# EAGLE schematic bitbang (EAGLE 7.4.0)
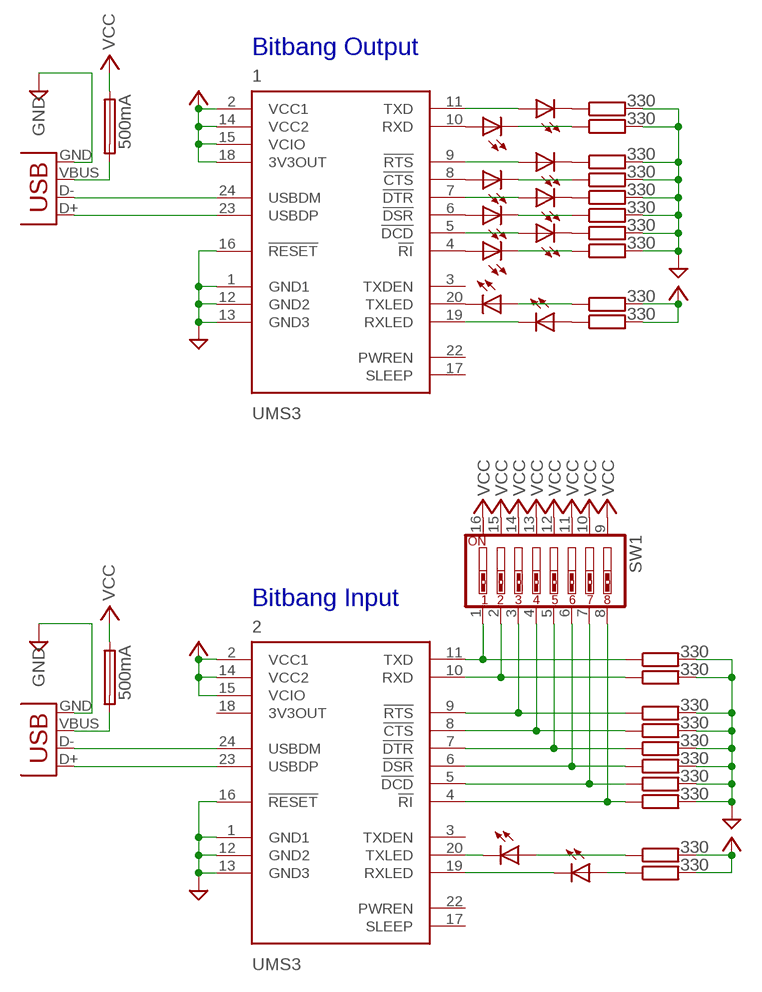
[diagram p0: schematic, sheet 1]

## Parts
1  UMS3  [DIL-24]
2  UMS3  [DIL-24]
F1  500mA  GSH15  [GSH15]
F2  500mA  GSH15  [GSH15]
LED1  LED3MM  [LED3MM]
LED2  LED3MM  [LED3MM]
LED3  LED3MM  [LED3MM]
LED4  LED3MM  [LED3MM]
LED5  LED3MM  [LED3MM]
LED6  LED3MM  [LED3MM]
LED7  LED3MM  [LED3MM]
LED8  LED3MM  [LED3MM]
R1  330  R-EU_0411/12  [0411/12]
R2  330  R-EU_0411/12  [0411/12]
R3  330  R-EU_0411/12  [0411/12]
R4  330  R-EU_0411/12  [0411/12]
R5  330  R-EU_0411/12  [0411/12]
R6  330  R-EU_0411/12  [0411/12]
R7  330  R-EU_0411/12  [0411/12]
R8  330  R-EU_0411/12  [0411/12]
R9  330  R-EU_0411/12  [0411/12]
R10  330  R-EU_0411/12  [0411/12]
R11  330  R-EU_0411/12  [0411/12]
R12  330  R-EU_0411/12  [0411/12]
R13  330  R-EU_0411/12  [0411/12]
R14  330  R-EU_0411/12  [0411/12]
R15  330  R-EU_0411/12  [0411/12]
R16  330  R-EU_0411/12  [0411/12]
R17  330  R-EU_0411/12  [0411/12]
R18  330  R-EU_0411/12  [0411/12]
R19  330  R-EU_0411/12  [0411/12]
R20  330  R-EU_0411/12  [0411/12]
RLED  LED3MM  [LED3MM]
RLED1  LED3MM  [LED3MM]
SW1  SW_DIP-8  [EDG-08]
TLED  LED3MM  [LED3MM]
TLED1  LED3MM  [LED3MM]
X1  USB-PTH  [USB-B-PTH]
X2  USB-PTH  [USB-B-PTH]

## Nets
GND: 1.1(GND1) 1.12(GND2) 1.13(GND3) 1.16(!RESET) 2.1(GND1) 2.12(GND2) 2.13(GND3) 2.16(!RESET) R3.2 R4.2 R5.2 R6.2 R7.2 R8.2 R9.2 R10.2 R13.2 R14.2 R15.2 R16.2 R17.2 R18.2 R19.2 R20.2 X2.GND
N$1: 1.24(USBDM) X1.D-
N$2: 1.23(USBDP) X1.D+
N$3: 1.11(TXD) LED1.A
N$4: 1.9(!RTS) LED3.A
N$5: 1.20(TXLED) TLED.K(C)
N$6: R1.1 RLED.A
N$7: 1.19(RXLED) RLED.K(C)
N$8: R2.1 TLED.A
N$9: 1.7(!DTR) LED5.A
N$10: 1.5(!DCD) LED7.A
N$11: LED1.K(C) R3.1
N$12: LED2.K(C) R4.1
N$13: LED3.K(C) R5.1
N$14: 1.10(RXD) LED2.A
N$15: 1.8(!CTS) LED4.A
N$16: LED4.K(C) R6.1
N$17: LED5.K(C) R7.1
N$18: LED7.K(C) R9.1
N$19: F1.2
N$20: LED8.K(C) R10.1
N$21: 1.4(!RI) LED8.A
N$22: 1.6(!DSR) LED6.A
N$23: LED6.K(C) R8.1
N$24: 2.24(USBDM) X2.D-
N$25: 2.23(USBDP) X2.D+
N$26: R11.1 RLED1.A
N$27: 2.19(RXLED) RLED1.K(C)
N$28: R12.1 TLED1.A
N$29: 2.20(TXLED) TLED1.K(C)
N$30: 2.11(TXD) R13.1 SW1.1
N$31: 2.10(RXD) R14.1 SW1.2
N$32: 2.9(!RTS) R15.1 SW1.3
N$33: 2.8(!CTS) R16.1 SW1.4
N$34: 2.7(!DTR) R17.1 SW1.5
N$35: 2.6(!DSR) R18.1 SW1.6
N$36: 2.5(!DCD) R19.1 SW1.7
N$37: 2.4(!RI) R20.1 SW1.8
N$38: F2.2 X2.VBUS
N$39: R11.2 R12.2 ; supply symbol labelled VCC
VCC: 1.2(VCC1) 1.14(VCC2) 1.15(VCIO) 1.18(3V3OUT) 2.2(VCC1) 2.14(VCC2) 2.15(VCIO) F1.1 F2.1 R1.2 R2.2 SW1.9 SW1.10 SW1.11 SW1.12 SW1.13 SW1.14 SW1.15 SW1.16
Unconnected: 1.3(TXDEN) 1.17(SLEEP) 1.22(PWREN) 2.3(TXDEN) 2.17(SLEEP) 2.18(3V3OUT) 2.22(PWREN) X1.GND X1.VBUS

## Notes on the sheet
- Bitbang Output
- Bitbang Input

## Library data of the parts
1 2 = ftdichip:UMS: Asix - UMS USB-UART Wrapper Module UMS3 is an USB->Serial interface module based on the powerful FT232RL chip made by FTDI. It enables very easy connection of the user's application to the PC via the USB port, without necessity of any deep knowledge about the complicated USB problematics. On the USB side of UMS3 there are 2 signals D+ and D-, on the opposite side there are the serial port signals (in the TTL level) with full data flow control. UMS3 is capable to transfer data at speeds up to 3 MBaud. UMS3 contains the on-chip EEPROM for storing the ID data (VID, PID, ID string) and the non-rewritable unique Serial number. UMS3 is manufactured as a DIP24 device with standard pin distance of 2.54 mm (0.1"). It can be put into standard or precision DIP socket or it can be directly soldered to user application PCB. It saves time and money in small medium volume production. The USB connector is to be connected separately, the designer has flexibility in the PCB layout and mechanical design in comparison to modules with built-in USB connector. Also, the A-type, B-type connector or even cable can be used. The UMS3 module supports all powerful features of the FT232R chip like BitBang mode, FTDIChip-ID? Security Dongle, Clock Generator Output, etc.). Another big feature is a 1.8 ... 5 V interface capability. After some minor changes in a target board, the UMS3 module can be used as an older UMS1 module replacement. The procedure is decribed in the User's Guide at http://www.asix.info.
F1 F2 = fuse:GSH15: FUSE HOLDER grid 15mm, 19649 Wickmann
LED1-LED8 RLED RLED1 TLED TLED1 = led:LED: LED OSRAM: - CHIPLED LG R971, LG N971, LY N971, LG Q971, LY Q971, LO R971, LY R971 LH N974, LH R974 LS Q976, LO Q976, LY Q976 LO Q996 - Hyper CHIPLED LW Q18S LB Q993, LB Q99A, LB R99A - SideLED LS A670, LO A670, LY A670, LG A670, LP A670 LB A673, LV A673, LT A673, LW A673 LH A674 LY A675 LS A676, LA A676, LO A676, LY A676, LW A676 LS A679, LY A679, LG A679 - Hyper Micro SIDELED® LS Y876, LA Y876, LO Y876, LY Y876 LT Y87S - SmartLED LW L88C, LW L88S LB L89C, LB L89S, LG L890 LS L89K, LO L89K, LY L89K LS L896, LA L896, LO L896, LY L896 - TOPLED LS T670, LO T670, LY T670, LG T670, LP T670 LSG T670, LSP T670, LSY T670, LOP T670, LYG T670 LG T671, LOG T671, LSG T671 LB T673, LV T673, LT T673, LW T673 LH T674 LS T676, LA T676, LO T676, LY T676, LB T676, LH T676, LSB T676, LW T676 LB T67C, LV T67C, LT T67C, LS T67K, LO T67K, LY T67K, LW E67C LS E67B, LA E67B, LO E67B, LY E67B, LB E67C, LV E67C, LT E67C LW T67C LS T679, LY T679, LG T679 LS T770, LO T770, LY T770, LG T770, LP T770 LB T773, LV T773, LT T773, LW T773 LH T774 LS E675, LA E675, LY E675, LS T675 LS T776, LA T776, LO T776, LY T776, LB T776 LHGB T686 LT T68C, LB T68C - Hyper Mini TOPLED® LB M676 - Mini TOPLED Santana® LG M470 LS M47K, LO M47K, LY M47K Source: http://www.osram.convergy.de LUXEON: - LUMILED® LXK2-PW12-R00, LXK2-PW12-S00, LXK2-PW14-U00, LXK2-PW14-V00 LXK2-PM12-R00, LXK2-PM12-S00, LXK2-PM14-U00 LXK2-PE12-Q00, LXK2-PE12-R00, LXK2-PE12-S00, LXK2-PE14-T00, LXK2-PE14-U00 LXK2-PB12-K00, LXK2-PB12-L00, LXK2-PB12-M00, LXK2-PB14-N00, LXK2-PB14-P00, LXK2-PB14-Q00 LXK2-PR12-L00, LXK2-PR12-M00, LXK2-PR14-Q00, LXK2-PR14-R00 LXK2-PD12-Q00, LXK2-PD12-R00, LXK2-PD12-S00 LXK2-PH12-R00, LXK2-PH12-S00 LXK2-PL12-P00, LXK2-PL12-Q00, LXK2-PL12-R00 Source: www.luxeon.com KINGBRIGHT: KA-3528ASYC Source: www.kingbright.com
R1-R20 = rcl:R-EU_: RESISTOR, European symbol
SW1 = special:SW_DIP-8: DIP SWITCH
X1 X2 = con-usb:USB: USB Connectors USB-B-PTH is fully proven SKU : PRT-00139 USB-miniB is fully proven SKU : PRT-00587 USB-A-PCB is untested. USB-A-H is throughly reviewed, but untested. Spark Fun Electronics SKU : PRT-00437 USB-B-SMT is throughly reviewed, but untested. Needs silkscreen touching up. USB-A-S has not been used/tested USB-MB-H has not been used/tested